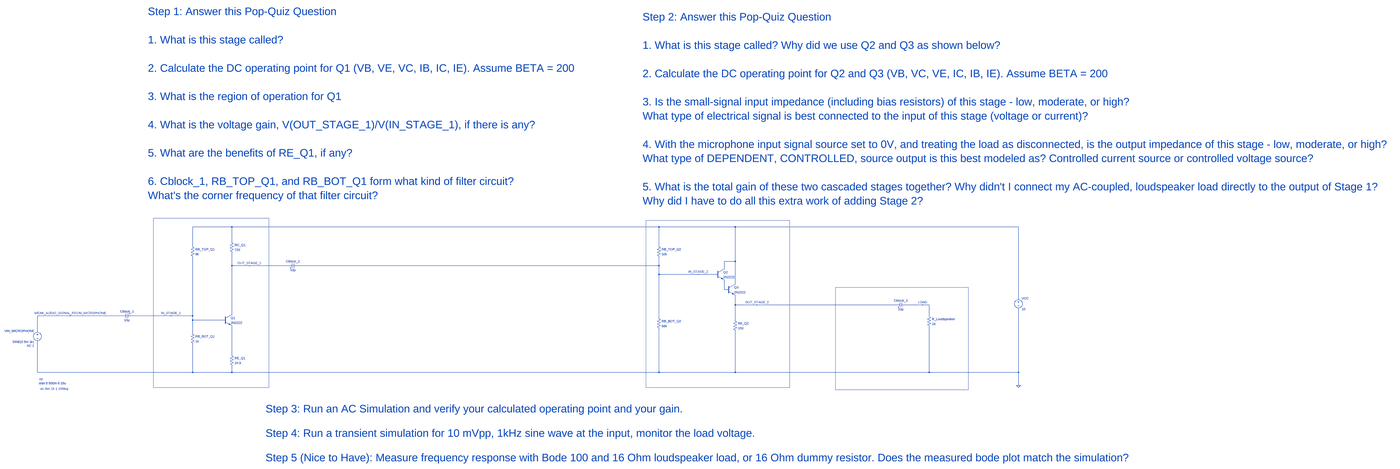
[diagram p0: schematic BJT_Audio_Amp_Design_Simulation_and_Questions.asc, whole sheet]
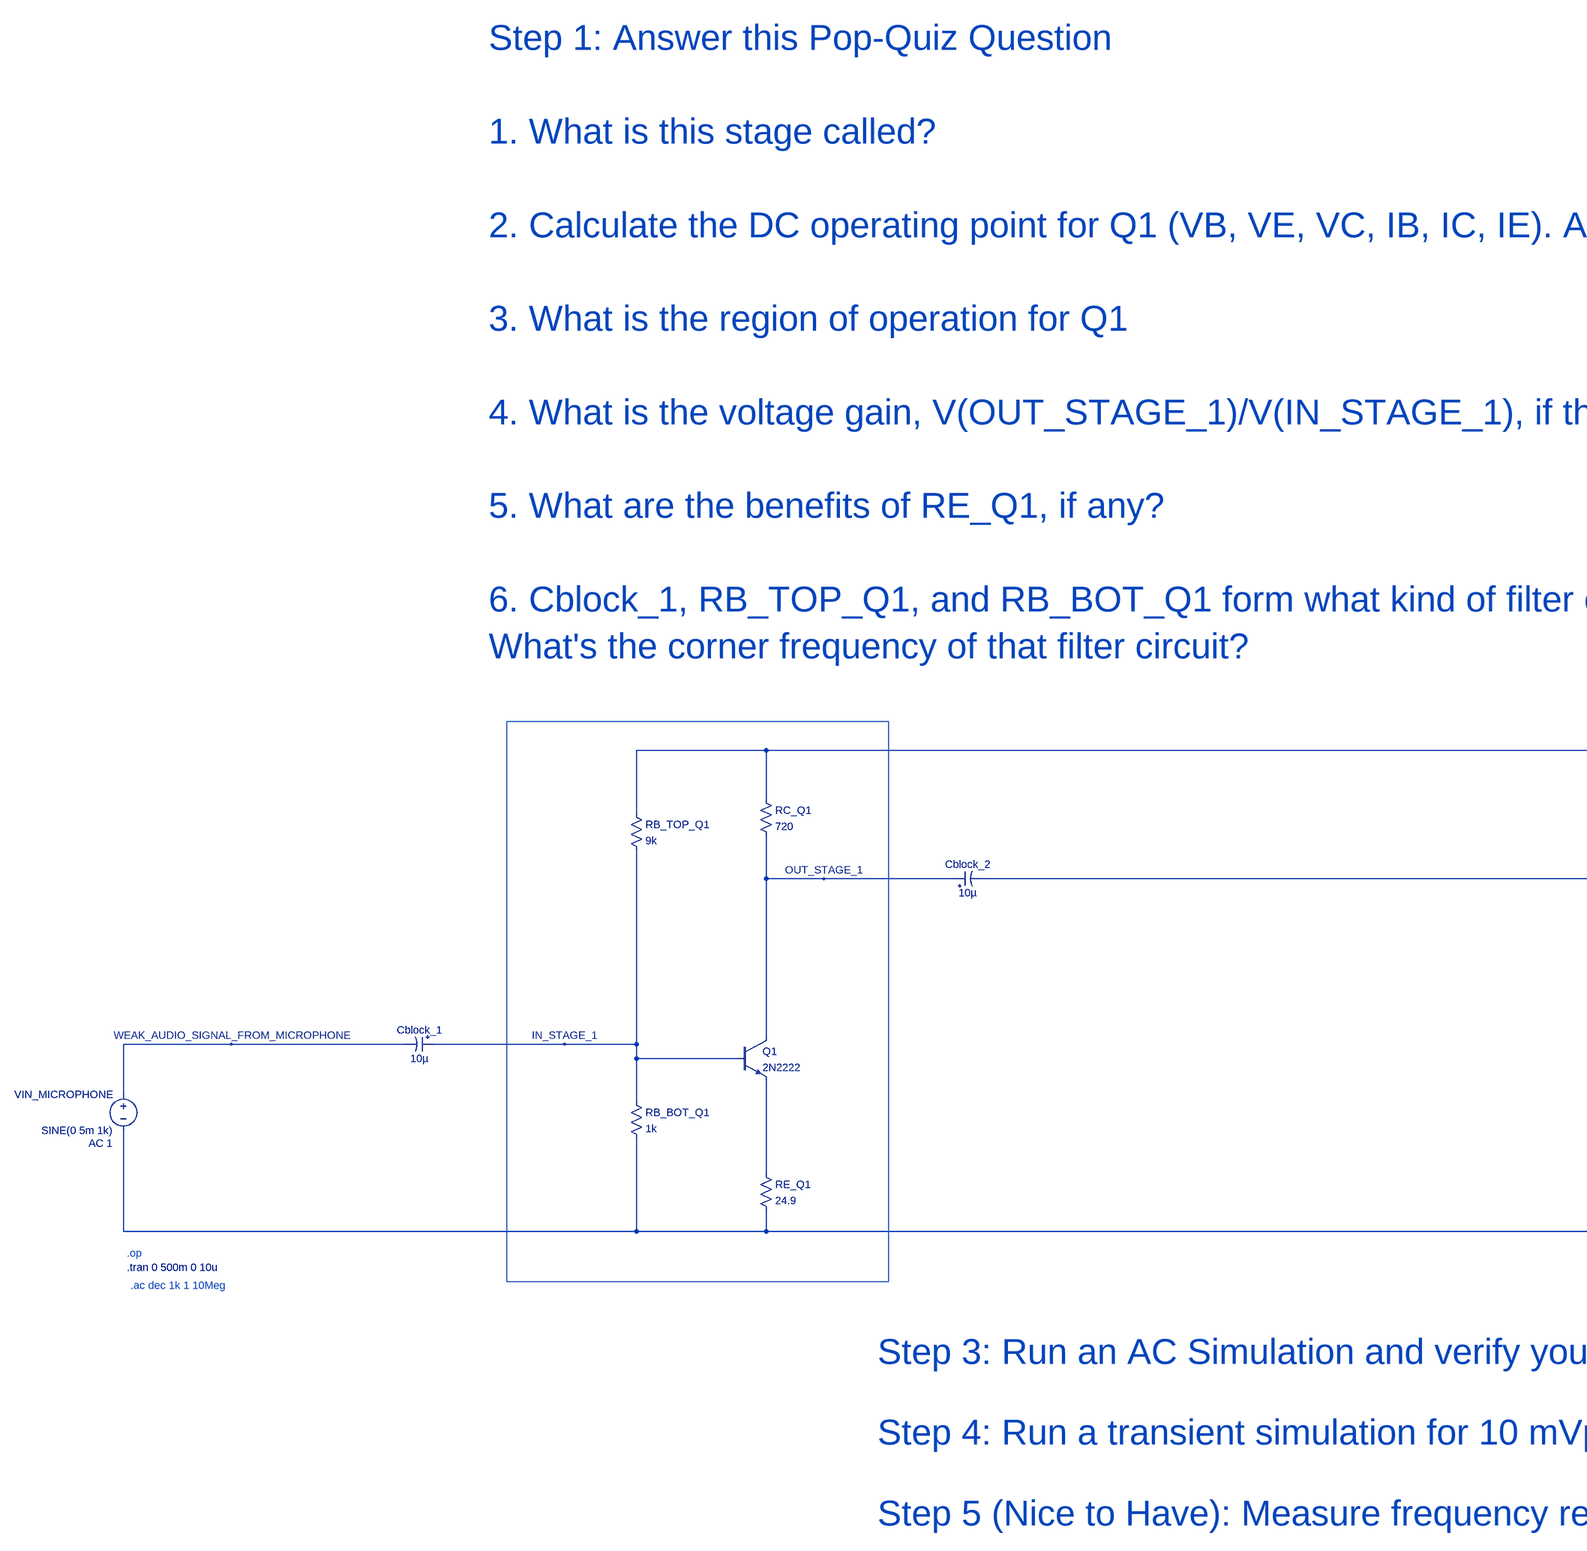
[diagram p1: schematic BJT_Audio_Amp_Design_Simulation_and_Questions.asc, part, row 1 of 1, column 1 of 3]
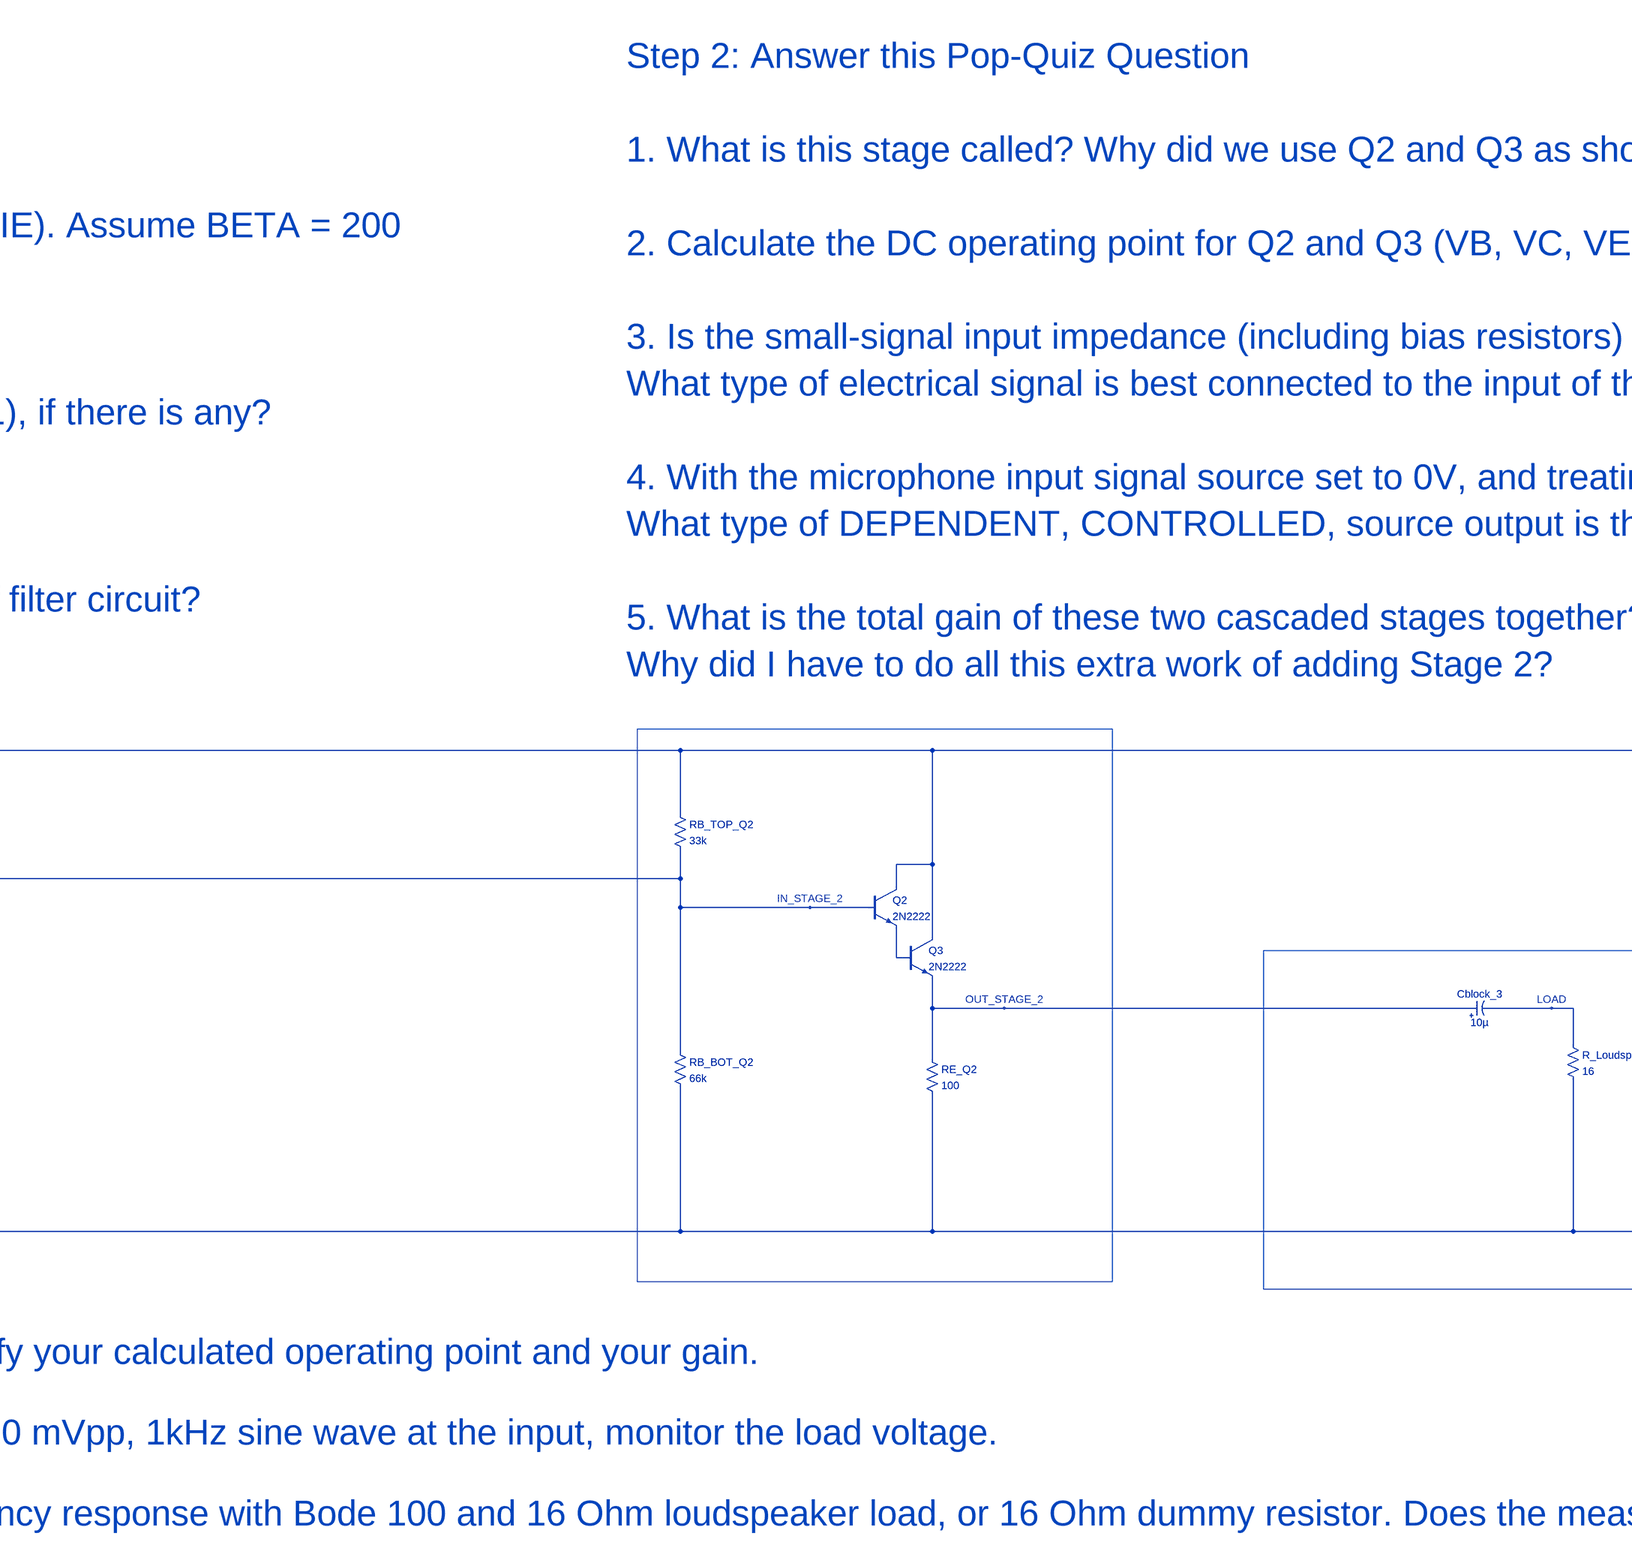
[diagram p2: schematic BJT_Audio_Amp_Design_Simulation_and_Questions.asc, part, row 1 of 1, column 2 of 3]
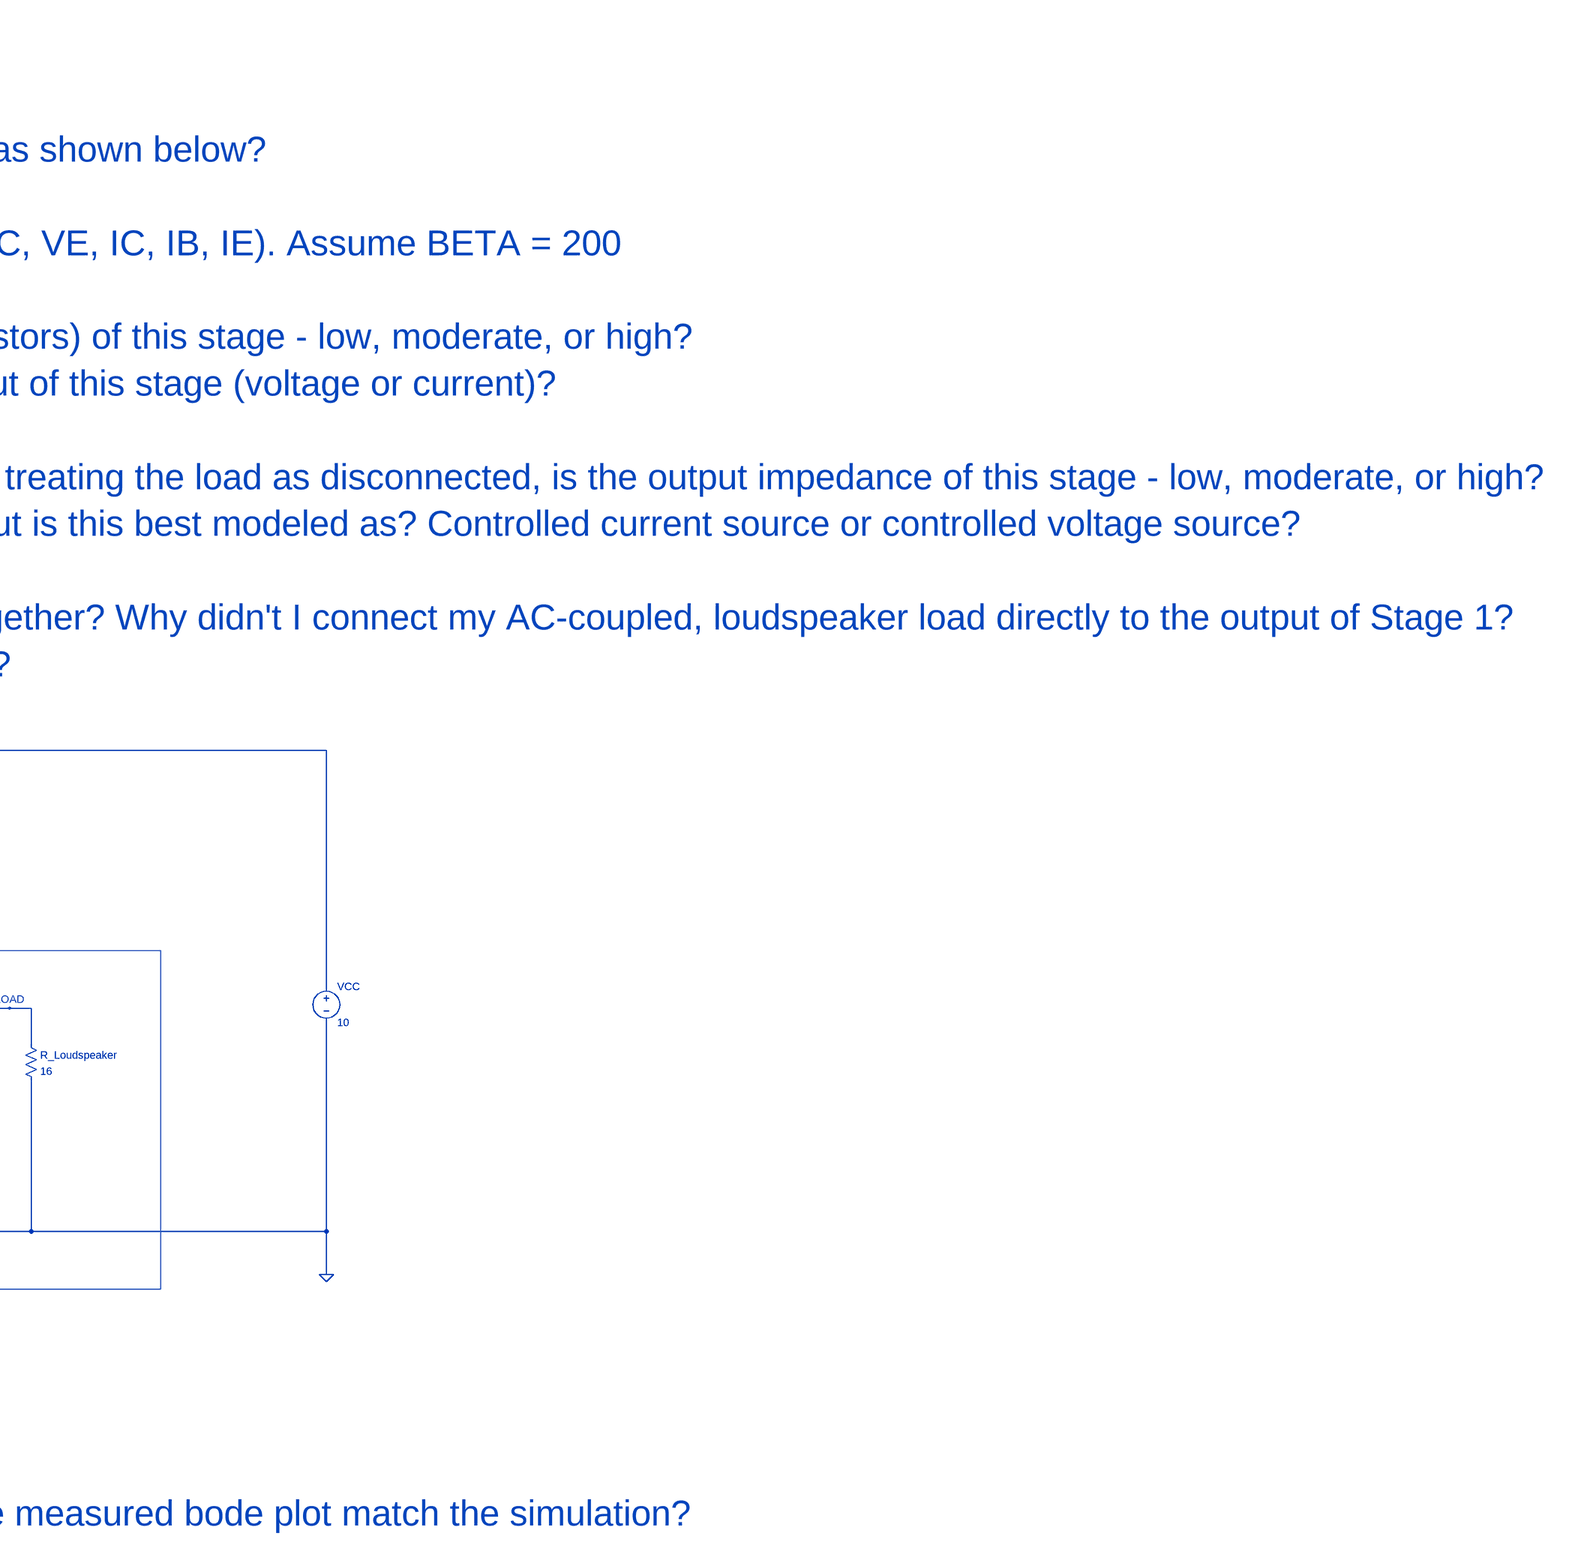
[diagram p3: schematic BJT_Audio_Amp_Design_Simulation_and_Questions.asc, part, row 1 of 1, column 3 of 3]
BJT_Audio_Amp_Design_Simulation_and_Questions.asc, the LTspice schematic file:
Version 4.1
SHEET 1 8508 2020
WIRE -2864 -784 -3152 -784
WIRE 272 -784 -2864 -784
WIRE 832 -784 272 -784
WIRE 2912 -784 832 -784
WIRE -2864 -640 -2864 -784
WIRE -3152 -608 -3152 -784
WIRE 272 -608 272 -784
WIRE 832 -496 832 -784
WIRE 832 -496 752 -496
WIRE -2864 -464 -2864 -560
WIRE -2736 -464 -2864 -464
WIRE -2448 -464 -2736 -464
WIRE 272 -464 272 -528
WIRE 272 -464 -2384 -464
WIRE 752 -448 752 -496
WIRE 272 -400 272 -464
WIRE 560 -400 272 -400
WIRE 688 -400 560 -400
WIRE 832 -336 832 -496
WIRE 752 -288 752 -352
WIRE 768 -288 752 -288
WIRE 2912 -224 2912 -784
WIRE 832 -176 832 -240
WIRE 992 -176 832 -176
WIRE 2016 -176 992 -176
WIRE 2208 -176 2080 -176
WIRE 2256 -176 2208 -176
WIRE -2864 -112 -2864 -464
WIRE -4144 -96 -4384 -96
WIRE -3696 -96 -4144 -96
WIRE -3312 -96 -3632 -96
WIRE -3152 -96 -3152 -528
WIRE -3152 -96 -3312 -96
WIRE 2256 -96 2256 -176
WIRE 272 -80 272 -400
WIRE -3152 -64 -3152 -96
WIRE -2928 -64 -3152 -64
WIRE 832 -64 832 -176
WIRE -4384 16 -4384 -96
WIRE -3152 32 -3152 -64
WIRE -2864 192 -2864 -16
WIRE -4384 320 -4384 96
WIRE -3152 320 -3152 112
WIRE -3152 320 -4384 320
WIRE -2864 320 -2864 272
WIRE -2864 320 -3152 320
WIRE 272 320 272 0
WIRE 272 320 -2864 320
WIRE 832 320 832 16
WIRE 832 320 272 320
WIRE 2256 320 2256 -16
WIRE 2256 320 832 320
WIRE 2912 320 2912 -144
WIRE 2912 320 2256 320
WIRE 2912 416 2912 320
FLAG 2912 416 0
FLAG -3312 -96 IN_STAGE_1
FLAG 2208 -176 LOAD
FLAG 992 -176 OUT_STAGE_2
FLAG -4144 -96 WEAK_AUDIO_SIGNAL_FROM_MICROPHONE
FLAG 560 -400 IN_STAGE_2
FLAG -2736 -464 OUT_STAGE_1
SYMBOL res 2240 -112 R0
SYMATTR InstName R_Loudspeaker
SYMATTR Value 16
SYMBOL voltage 2912 -240 R0
WINDOW 123 0 0 Left 0
WINDOW 39 0 0 Left 0
SYMATTR InstName VCC
SYMATTR Value 10
SYMBOL voltage -4384 0 M0
WINDOW 123 24 124 Left 2
WINDOW 39 0 0 Left 0
SYMATTR Value2 AC 1
SYMATTR InstName VIN_MICROPHONE
SYMATTR Value SINE(0 5m 1k)
SYMBOL polcap -3632 -112 R90
WINDOW 0 0 32 VBottom 2
WINDOW 3 32 32 VTop 2
SYMATTR InstName Cblock_1
SYMATTR Value 10µ
SYMBOL polcap -2448 -448 R270
WINDOW 0 32 32 VTop 2
WINDOW 3 0 32 VBottom 2
SYMATTR InstName Cblock_2
SYMATTR Value 10µ
SYMBOL npn 768 -336 R0
SYMATTR InstName Q3
SYMATTR Value 2N2222
SYMBOL res 816 -80 R0
SYMATTR InstName RE_Q2
SYMATTR Value 100
SYMBOL res 256 -624 R0
SYMATTR InstName RB_TOP_Q2
SYMATTR Value 33k
SYMBOL res 256 -96 R0
SYMATTR InstName RB_BOT_Q2
SYMATTR Value 66k
SYMBOL polcap 2016 -160 R270
WINDOW 0 32 32 VTop 2
WINDOW 3 0 32 VBottom 2
SYMATTR InstName Cblock_3
SYMATTR Value 10µ
SYMBOL npn -2928 -112 R0
SYMATTR InstName Q1
SYMATTR Value 2N2222
SYMBOL res -3168 -624 R0
SYMATTR InstName RB_TOP_Q1
SYMATTR Value 9k
SYMBOL res -3168 16 R0
SYMATTR InstName RB_BOT_Q1
SYMATTR Value 1k
SYMBOL res -2880 176 R0
SYMATTR InstName RE_Q1
SYMATTR Value 24.9
SYMBOL res -2880 -656 R0
SYMATTR InstName RC_Q1
SYMATTR Value 720
SYMBOL npn 688 -448 R0
SYMATTR InstName Q2
SYMATTR Value 2N2222
TEXT -4376 368 Left 2 ;.op
TEXT -4376 400 Left 2 !.tran 0 500m 0 10u
TEXT -4368 440 Left 2 ;.ac dec 1k 1 10Meg
TEXT -3480 -2368 Left 6 ;Step 1: Answer this Pop-Quiz Question\n \n1. What is this stage called?\n \n2. Calculate the DC operating point for Q1 (VB, VE, VC, IB, IC, IE). Assume BETA = 200\n \n3. What is the region of operation for Q1\n \n4. What is the voltage gain, V(OUT_STAGE_1)/V(IN_STAGE_1), if there is any?\n \n5. What are the benefits of RE_Q1, if any?\n \n6. Cblock_1, RB_TOP_Q1, and RB_BOT_Q1 form what kind of filter circuit? \nWhat's the corner frequency of that filter circuit?
TEXT 152 -2328 Left 6 ;Step 2: Answer this Pop-Quiz Question\n \n1. What is this stage called? Why did we use Q2 and Q3 as shown below?\n \n2. Calculate the DC operating point for Q2 and Q3 (VB, VC, VE, IC, IB, IE). Assume BETA = 200\n \n3. Is the small-signal input impedance (including bias resistors) of this stage - low, moderate, or high?\nWhat type of electrical signal is best connected to the input of this stage (voltage or current)?\n \n4. With the microphone input signal source set to 0V, and treating the load as disconnected, is the output impedance of this stage - low, moderate, or high?\nWhat type of DEPENDENT, CONTROLLED, source output is this best modeled as? Controlled current source or controlled voltage source?\n \n5. What is the total gain of these two cascaded stages together? Why didn't I connect my AC-coupled, loudspeaker load directly to the output of Stage 1?\nWhy did I have to do all this extra work of adding Stage 2?
TEXT -2616 944 Left 6 ;Step 3: Run an AC Simulation and verify your calculated operating point and your gain.\n \nStep 4: Run a transient simulation for 10 mVpp, 1kHz sine wave at the input, monitor the load voltage.\n \nStep 5 (Nice to Have): Measure frequency response with Bode 100 and 16 Ohm loudspeaker load, or 16 Ohm dummy resistor. Does the measured bode plot match the simulation?
RECTANGLE Normal -2592 432 -3440 -848
RECTANGLE Normal 1232 432 176 -832
RECTANGLE Normal 2544 448 1568 -304

The netlist it stands for:
* BJT_Audio_Amp_Design_Simulation_and_Questions.asc
R_Loudspeaker LOAD 0 16
VCC N001 0 10
VIN_MICROPHONE WEAK_AUDIO_SIGNAL_FROM_MICROPHONE 0 SINE(0 5m 1k) AC 1
Cblock_1 IN_STAGE_1 WEAK_AUDIO_SIGNAL_FROM_MICROPHONE 10µ
Cblock_2 OUT_STAGE_1 IN_STAGE_2 10µ
Q3 N001 N002 OUT_STAGE_2 0 2N2222
RE_Q2 OUT_STAGE_2 0 100
RB_TOP_Q2 N001 IN_STAGE_2 33k
RB_BOT_Q2 IN_STAGE_2 0 66k
Cblock_3 OUT_STAGE_2 LOAD 10µ
Q1 OUT_STAGE_1 IN_STAGE_1 N003 0 2N2222
RB_TOP_Q1 N001 IN_STAGE_1 9k
RB_BOT_Q1 IN_STAGE_1 0 1k
RE_Q1 N003 0 24.9
RC_Q1 N001 OUT_STAGE_1 720
Q2 N001 IN_STAGE_2 N002 0 2N2222
.model NPN NPN
.model PNP PNP
.lib standard.bjt
* .op
.tran 0 500m 0 10u
* .ac dec 1k 1 10Meg
* Step 1: Answer this Pop-Quiz Question
* 1. What is this stage called?
* 2. Calculate the DC operating point for Q1 (VB, VE, VC, IB, IC, IE). Assume BETA = 200
* 3. What is the region of operation for Q1
* 4. What is the voltage gain, V(OUT_STAGE_1)/V(IN_STAGE_1), if there is any?
* 5. What are the benefits of RE_Q1, if any?
* 6. Cblock_1, RB_TOP_Q1, and RB_BOT_Q1 form what kind of filter circuit?
* What's the corner frequency of that filter circuit?
* Step 2: Answer this Pop-Quiz Question
* 1. What is this stage called? Why did we use Q2 and Q3 as shown below?
* 2. Calculate the DC operating point for Q2 and Q3 (VB, VC, VE, IC, IB, IE). Assume BETA = 200
* 3. Is the small-signal input impedance (including bias resistors) of this stage - low, moderate, or high?
* What type of electrical signal is best connected to the input of this stage (voltage or current)?
* 4. With the microphone input signal source set to 0V, and treating the load as disconnected, is the output impedance of this stage - low, moderate, or high?
* What type of DEPENDENT, CONTROLLED, source output is this best modeled as? Controlled current source or controlled voltage source?
* 5. What is the total gain of these two cascaded stages together? Why didn't I connect my AC-coupled, loudspeaker load directly to the output of Stage 1?
* Why did I have to do all this extra work of adding Stage 2?
* Step 3: Run an AC Simulation and verify your calculated operating point and your gain.
* Step 4: Run a transient simulation for 10 mVpp, 1kHz sine wave at the input, monitor the load voltage.
* Step 5 (Nice to Have): Measure frequency response with Bode 100 and 16 Ohm loudspeaker load, or 16 Ohm dummy resistor. Does the measured bode plot match the simulation?
.backanno
.end